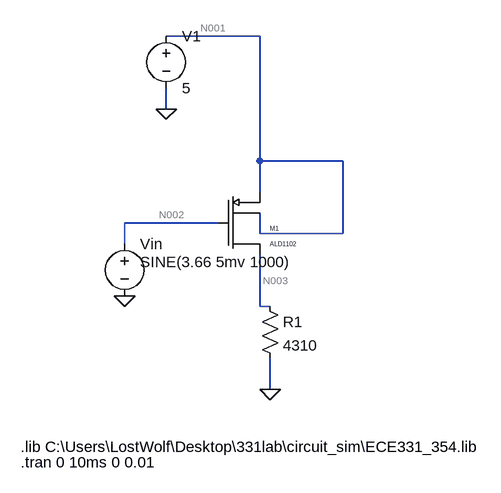
[diagram p0: schematic lab1_pmos_sine.asc]
lab1_pmos_sine.asc, the LTspice schematic file:
Version 4
SHEET 1 880 680
WIRE -192 -464 -336 -464
WIRE -336 -352 -336 -384
WIRE -192 -272 -192 -464
WIRE -64 -272 -192 -272
WIRE -192 -224 -192 -272
WIRE -256 -176 -400 -176
WIRE -192 -160 -192 -192
WIRE -64 -160 -64 -272
WIRE -64 -160 -192 -160
WIRE -400 -144 -400 -176
WIRE -192 -48 -192 -128
WIRE -176 -48 -192 -48
WIRE -176 80 -176 32
FLAG -176 80 0
FLAG -336 -352 0
FLAG -400 -64 0
SYMBOL voltage -336 -480 R0
WINDOW 123 0 0 Left 2
WINDOW 39 0 0 Left 2
SYMATTR InstName V1
SYMATTR Value 5
SYMBOL ALD1102 -256 -224 R0
SYMATTR InstName M1
SYMBOL voltage -400 -160 R0
WINDOW 3 24 44 Left 2
WINDOW 123 24 124 Left 2
WINDOW 39 0 0 Left 2
SYMATTR Value SINE(3.66 5mv 1000)
SYMATTR InstName Vin
SYMBOL res -192 -64 R0
SYMATTR InstName R1
SYMATTR Value 4310
TEXT -560 168 Left 2 !.lib C:\\Users\\LostWolf\\Desktop\\331lab\\circuit_sim\\ECE331_354.lib
TEXT -560 192 Left 2 !.tran 0 10ms 0 0.01

The netlist it stands for:
* lab1_pmos_sine.asc
V1 N001 0 5
M1 N003 N002 N001 N001 ALD1102 W=1.739e-3 L=1e-6
Vin N002 0 SINE(3.66 5mv 1000)
R1 N003 0 4310
.model NMOS NMOS
.model PMOS PMOS
.lib standard.mos
.lib C:\Users\LostWolf\Desktop\331lab\circuit_sim\ECE331_354.lib
.tran 0 10ms 0 0.01
.backanno
.end

* Results of the author's LTspice run, read from the files saved beside the schematic
* Operating Point, zero values left out:
*   V(n001) = 5 V
*   V(n003) = 2.372 V
*   V(n002) = 3.66 V
*   Id(M1) = -550.4 µA
*   Ib(M1) = 2.623 pA
*   Is(M1) = 550.4 µA
*   I(R1) = 550.4 µA
*   I(V1) = -550.4 µA
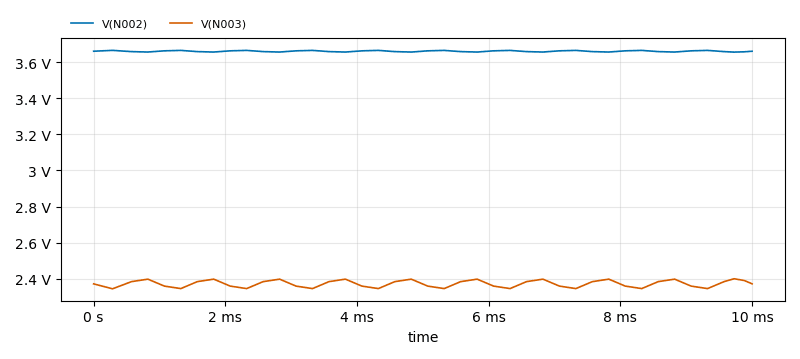
[diagram p1: Transient Analysis of lab1_pmos_sine.asc, plotted from the saved traces]
* Transient Analysis, 1 run:
*   V(N002): min 3.655 V, max 3.665 V, average 3.66 V, rms 3.66 V, last 3.66 V
*   V(N003): min 2.345 V, max 2.401 V, average 2.373 V, rms 2.373 V, last 2.372 V